# EAGLE design LibreServo_v1 (EAGLE 7.6.0)
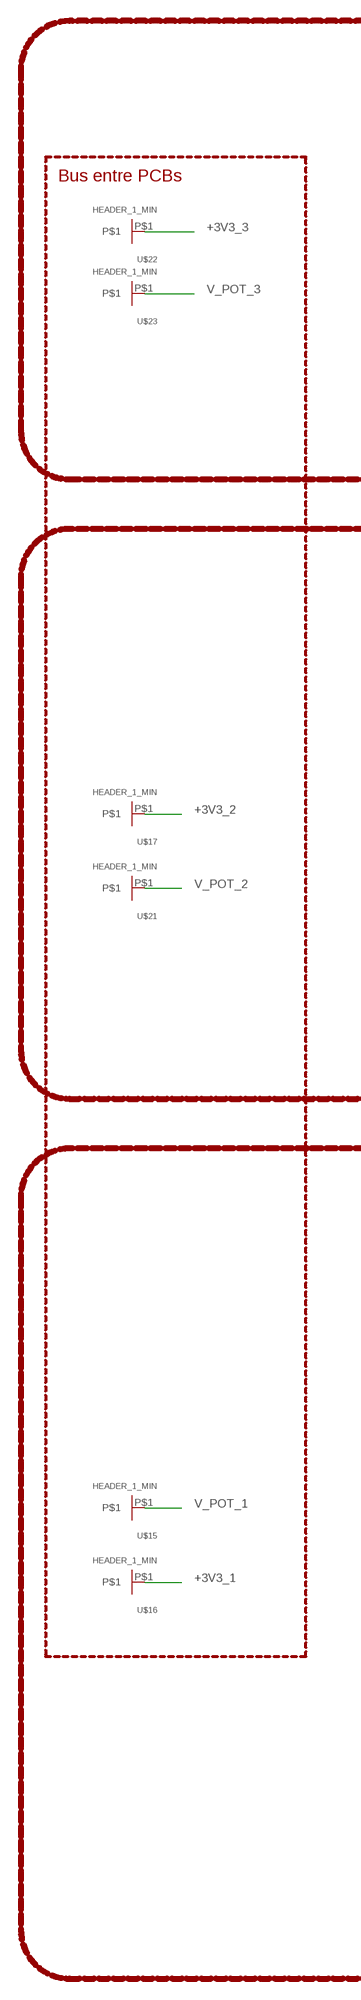
[diagram p0: schematic, sheet 1, part 1 of 2]
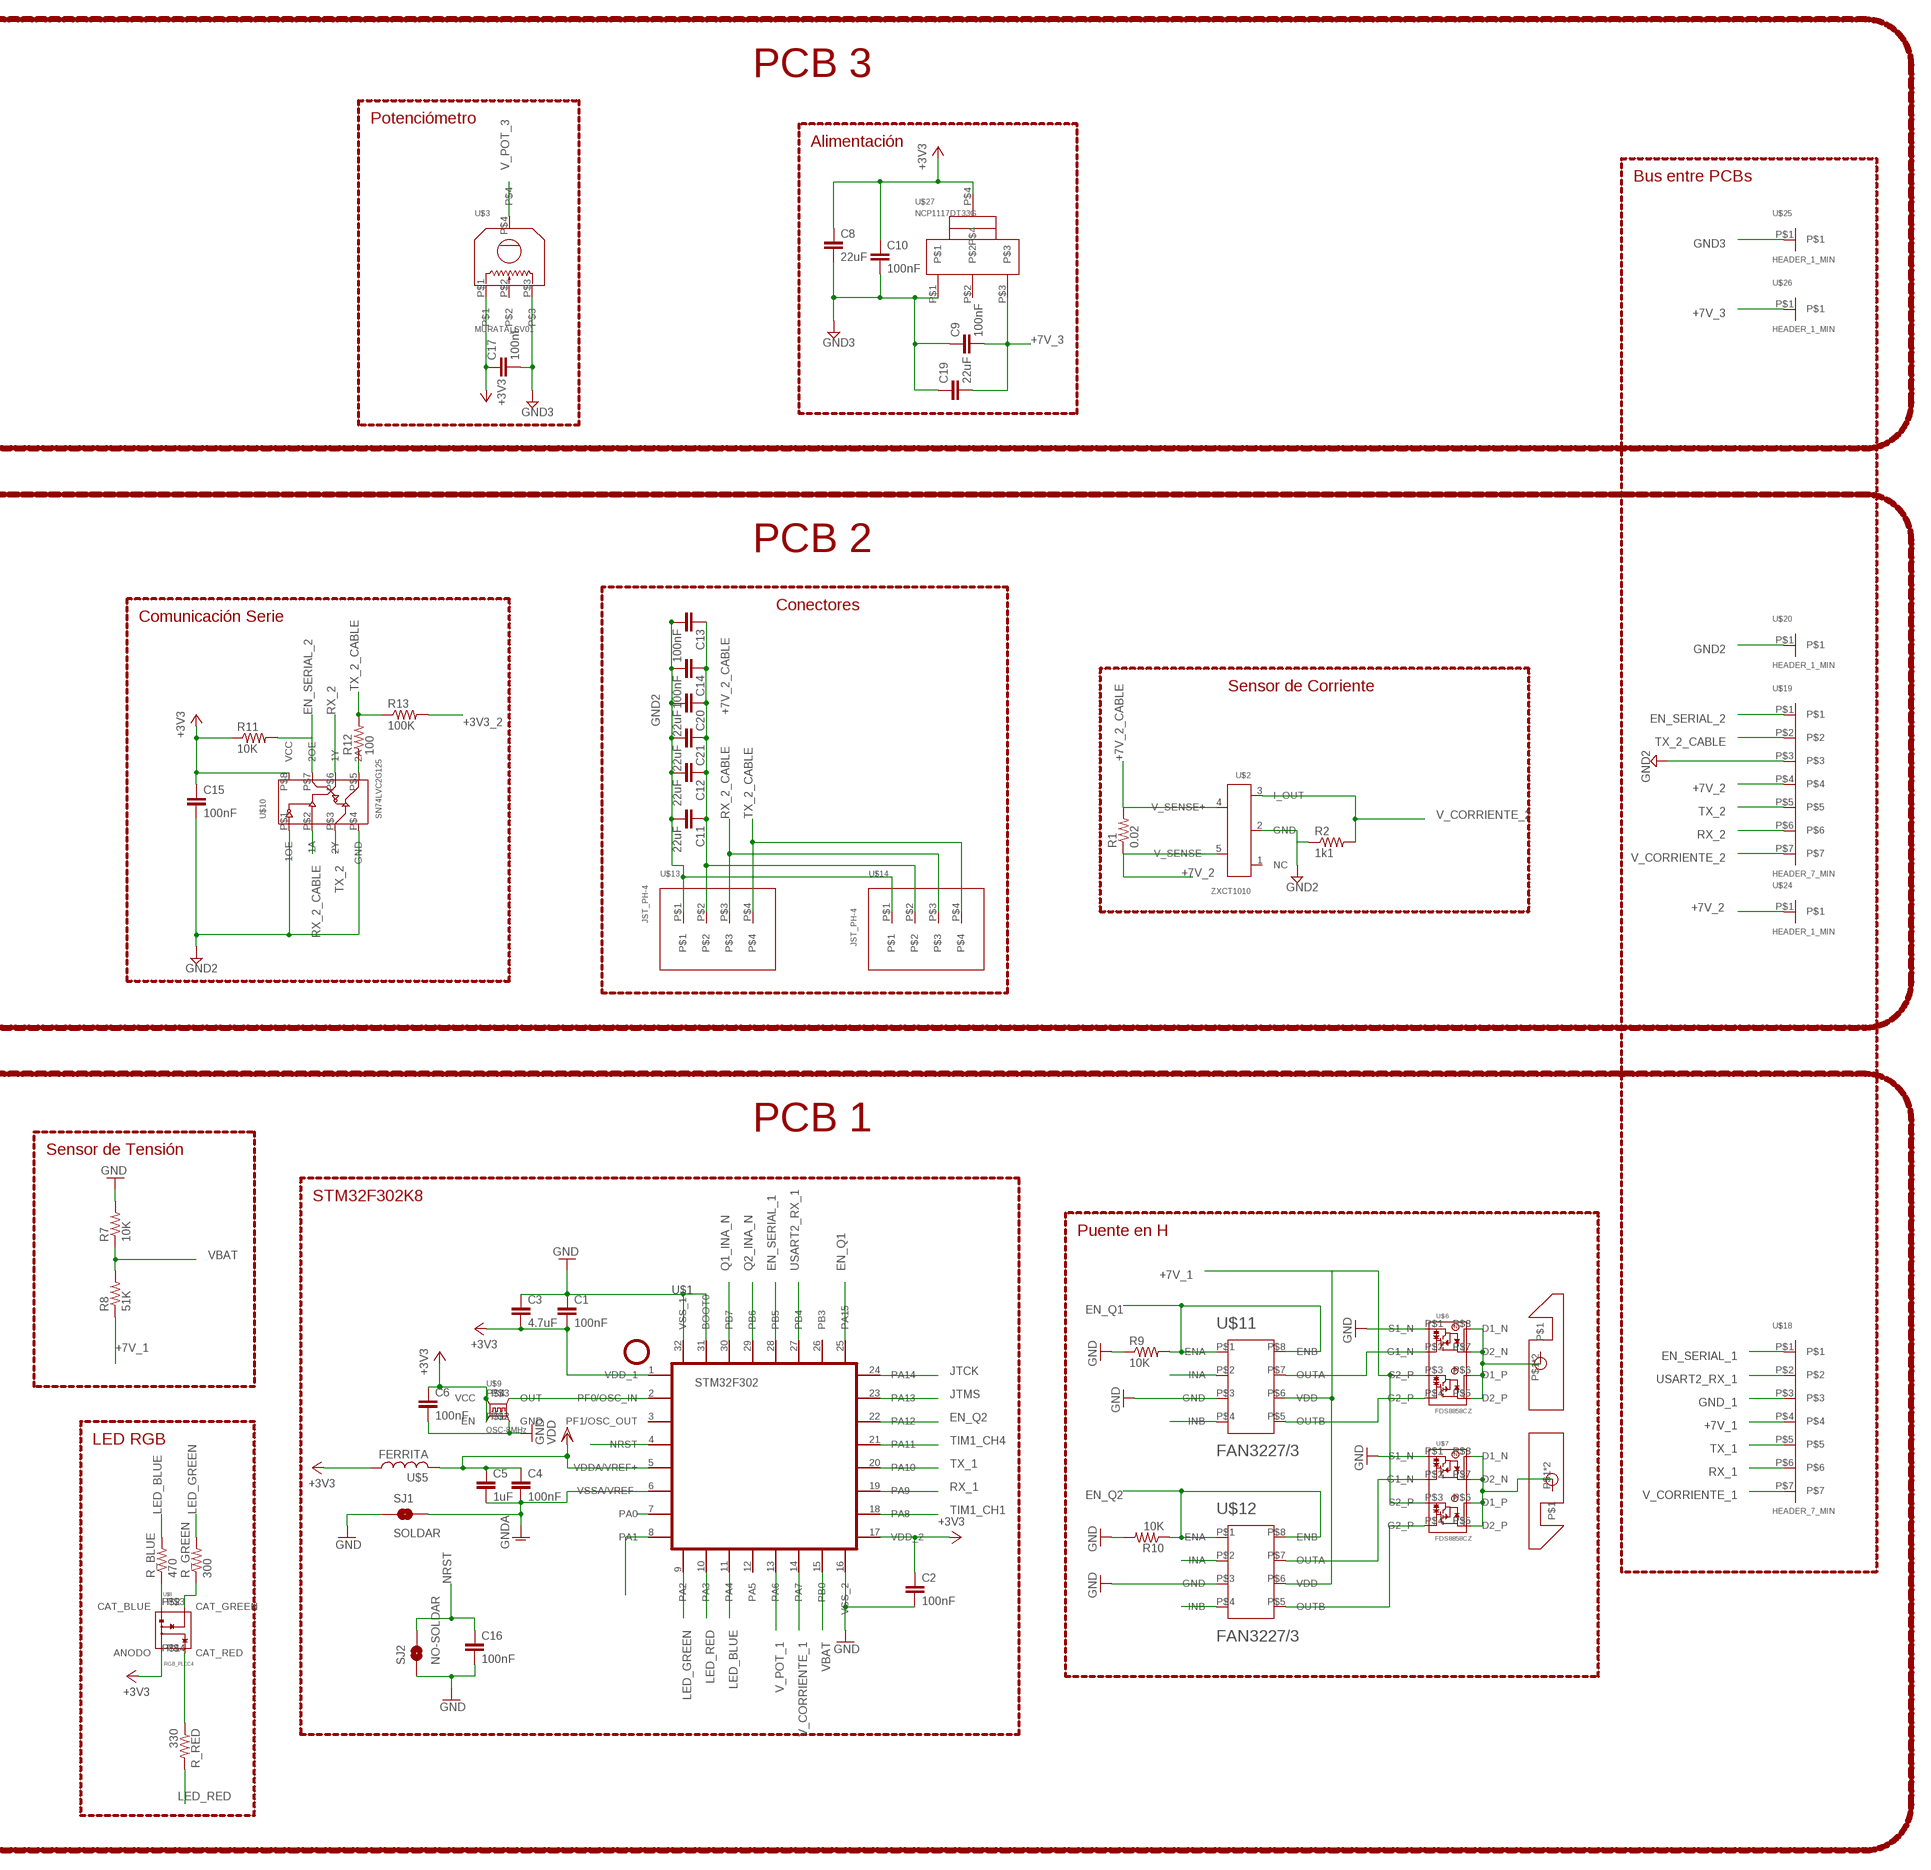
[diagram p1: schematic, sheet 1, part 2 of 2]

## Parts
C1  100nF  C-EUC0402  [C0402]
C2  100nF  C-EUC0402  [C0402]
C3  4.7uF  C-EUC0402  [C0402]
C4  100nF  C-EUC0402  [C0402]
C5  1uF  C-EUC0402  [C0402]
C6  100nF  C-EUC0402  [C0402]
C8  22uF  C-EU0805-MIN  [0805_MIN]
C9  100nF  C-EUC0402  [C0402]
C10  100nF  C-EUC0402  [C0402]
C11  22uF  C-EU0805-MIN  [0805_MIN]
C12  22uF  C-EU0805-MIN  [0805_MIN]
C13  100nF  C-EUC0402  [C0402]
C14  100nF  C-EUC0402  [C0402]
C15  100nF  C-EUC0402  [C0402]
C16  100nF  C-EUC0402  [C0402]
C17  100nF  C-EUC0402  [C0402]
C19  22uF  C-EU0805-MIN  [0805_MIN]
C20  22uF  C-EU0805-MIN  [0805_MIN]
C21  22uF  C-EU0805-MIN  [0805_MIN]
R1  0.02  R-US  [1206_ESTRECHA]
R2  1k1  R-US_R0402  [R0402]
R7  10K  R-US_R0402  [R0402]
R8  51K  R-US_R0402  [R0402]
R9  10K  R-US_R0402  [R0402]
R10  10K  R-US_R0402  [R0402]
R11  10K  R-US_R0402  [R0402]
R12  100  R-US_R0402  [R0402]
R13  100K  R-US_R0402  [R0402]
R_BLUE  470  R-US_R0402  [R0402]
R_GREEN  300  R-US_R0402  [R0402]
R_RED  330  R-US_R0402  [R0402]
SJ1  SOLDAR  SOLDERJUMPERNC  [SJ_2S]
SJ2  NO-SOLDAR  SOLDERJUMPERNO  [SJ_2S-NO]
U$1  STM32F302  [QFN32]
U$2  ZXCT1010  [SOT25]
U$3  MURATA_SV01  MURATA_SV01MURA  [MURATA_SV01]
U$4  PAD_LIBRE_SERVO_V1_A  [PAD_LIBRE_SERVO_V1_A]
U$5  FERRITA  FERRITE_BEAD_0402  [0402]
U$6  FDS8858CZ  [SO-8]
U$7  FDS8858CZ  [SO-8]
U$8  RGB_PLCC4  LED_RGB_PLCC4  [PLCC4]
U$9  OSC-8MHz  OSC-2.5X2OSC  [OSC-2.5X2]
U$10  SN74LVC2G125  [VSSOP-8]
U$11  FAN3227/3  [MLP8]
U$12  FAN3227/3  [MLP8]
U$13  JST_PH-4  JST_PH-4_HOLE  [JST_PH-4_HOLE]
U$14  JST_PH-4  JST_PH-4_HOLE  [JST_PH-4_HOLE]
U$15  HEADER_1_MIN  [HEADER_1_MIN]
U$16  HEADER_1_MIN  [HEADER_1_MIN]
U$17  HEADER_1_MIN  [HEADER_1_MIN]
U$18  HEADER_7_MIN  [HEADER_7_MIN]
U$19  HEADER_7_MIN  [HEADER_7_MIN]
U$20  HEADER_1_MIN  [HEADER_1_MIN]
U$21  HEADER_1_MIN  [HEADER_1_MIN]
U$22  HEADER_1_MIN  [HEADER_1_MIN]
U$23  HEADER_1_MIN  [HEADER_1_MIN]
U$24  HEADER_1_MIN  [HEADER_1_MIN]
U$25  HEADER_1_MIN  [HEADER_1_MIN]
U$26  HEADER_1_MIN  [HEADER_1_MIN]
U$27  NCP1117DT33G  NCP1117_MOD  [SOT223_MOD]
U$28  PAD_LIBRE_SERVO_V1_B  [PAD_LIBRE_SERVO_V1_B]

## Nets
+3V3_1: C1.2 C2.1 C3.2 C6.1 U$1.1(VDD_1) U$1.17(VDD_2) U$5.1 U$8.P$1(ANODO) U$9.P$1(EN) U$9.P$4(VCC) U$16.P$1 ; supply symbol labelled +3V3
+3V3_2: C15.1 R11.1 R13.2 U$10.P$8(VCC) U$17.P$1 ; supply symbol labelled +3V3
+3V3_3: C8.1 C10.1 C17.1 U$3.P$1 U$22.P$1 U$27.P$4 ; supply symbol labelled +3V3
+7V_1: R8.1 U$6.P$3(S2_P) U$7.P$3(S2_P) U$11.P$6(VDD) U$12.P$6(VDD) U$18.P$4
+7V_2: R1.1 U$2.5(V_SENSE-) U$19.P$4 U$24.P$1
+7V_2_CABLE: C11.1 C12.1 C13.1 C14.1 C20.1 C21.1 R1.2 U$2.4(V_SENSE+) U$13.P$2 U$14.P$2
+7V_3: C9.2 C19.2 U$26.P$1 U$27.P$3
EN_Q1: R9.2 U$1.25(PA15) U$11.P$1(ENA) U$11.P$8(ENB)
EN_Q2: R10.1 U$1.22(PA12) U$12.P$1(ENA) U$12.P$8(ENB)
EN_SERIAL_1: U$1.28(PB5) U$18.P$1
EN_SERIAL_2: R11.2 U$10.P$7(2OE) U$19.P$1
GND2: C11.2 C12.2 C13.2 C14.2 C15.2 C20.2 C21.2 R2.1 U$2.2(GND) U$10.P$1(1OE) U$10.P$4(GND) U$13.P$1 U$14.P$1 U$19.P$3 U$20.P$1
GND3: C8.2 C9.1 C10.2 C17.2 C19.1 U$3.P$3 U$25.P$1 U$27.P$1
GND_1: C1.1 C2.2 C3.1 C6.2 C16.2 R7.2 R9.1 R10.2 SJ1.1 SJ2.1 U$1.16(VSS_2) U$1.31(BOOT0) U$1.32(VSS_1) U$6.P$1(S1_N) U$7.P$1(S1_N) U$9.P$2(GND) U$11.P$3(GND) U$12.P$3(GND) U$18.P$3 ; supply symbol labelled GND
GNDA: C4.2 C5.2 SJ1.2 U$1.6(VSSA/VREF-)
JTCK: U$1.24(PA14)
JTMS: U$1.23(PA13)
LED_BLUE: R_BLUE.2 U$1.11(PA4)
LED_GREEN: R_GREEN.2 U$1.9(PA2)
LED_RED: R_RED.2 U$1.10(PA3)
N$1: R_BLUE.1 U$8.P$2(CAT_BLUE)
N$2: R_GREEN.1 U$8.P$3(CAT_GREEN)
N$3: R_RED.1 U$8.P$4(CAT_RED)
N$5: U$1.2(PF0/OSC_IN) U$9.P$3(OUT)
N$6: U$1.8(PA1)
N$7: U$1.7(PA0)
N$8: R12.1 U$10.P$5(2A)
N$10: U$6.P$2(G1_N) U$11.P$7(OUTA)
N$14: U$6.P$4(G2_P) U$11.P$5(OUTB)
N$15: U$7.P$2(G1_N) U$12.P$7(OUTA)
N$18: U$7.P$4(G2_P) U$12.P$5(OUTB)
N$19: U$6.P$5(D2_P) U$6.P$6(D1_P) U$6.P$7(D2_N) U$6.P$8(D1_N) U$28.P$1 U$28.P$2
N$26: U$4.P$1 U$4.P$2 U$7.P$5(D2_P) U$7.P$6(D1_P) U$7.P$7(D2_N) U$7.P$8(D1_N)
NRST: C16.1 SJ2.2 U$1.4(NRST)
Q1_INA_N: U$1.30(PB7) U$11.P$2(INA)
Q2_INA_N: U$1.29(PB6) U$12.P$2(INA)
RX_1: U$1.19(PA9) U$18.P$6
RX_2: U$10.P$6(1Y) U$19.P$6
RX_2_CABLE: U$10.P$2(1A) U$13.P$3 U$14.P$3
TIM1_CH1: U$1.18(PA8) U$12.P$4(INB)
TIM1_CH4: U$1.21(PA11) U$11.P$4(INB)
TX_1: U$1.20(PA10) U$18.P$5
TX_2: U$10.P$3(2Y) U$19.P$5
TX_2_CABLE: R12.2 R13.1 U$13.P$4 U$14.P$4 U$19.P$2
USART2_RX_1: U$1.27(PB4) U$18.P$2
V_CORRIENTE_1: U$1.14(PA7) U$18.P$7
V_CORRIENTE_2: R2.2 U$2.3(I_OUT) U$19.P$7
V_POT_1: U$1.13(PA6) U$15.P$1
V_POT_2: U$21.P$1
V_POT_3: U$3.P$4 U$23.P$1
VBAT: R7.1 R8.2 U$1.15(PB0)
VDD: C4.1 C5.1 U$1.5(VDDA/VREF+) U$5.2
Unconnected: U$1.3(PF1/OSC_OUT) U$1.12(PA5) U$1.26(PB3) U$2.1(NC) U$3.P$2 U$27.P$2

## Notes on the sheet
- PCB 3
- Potenciómetro
- Alimentación
- Bus entre PCBs
- Bus entre PCBs
- PCB 2
- Conectores
- Comunicación Serie
- Sensor de Corriente
- PCB 1
- Sensor de Tensión
- STM32F302K8
- Puente en H
- LED RGB

## Library data of the parts
C1-C6 C9 C10 C13-C17 = rcl:C-EU: CAPACITOR, European symbol
C8 C11 C12 C19-C21 = Propio:C-EU
R1 = Propio:R-US
R2 R7-R13 R_BLUE R_GREEN R_RED = rcl:R-US_: RESISTOR, American symbol
SJ1 SJ2 = SparkFun-Passives:SOLDERJUMPER: Solder Jumper Standard SMD solder jumper. Used to automate production. Two varients : Normally Open and Normally Closed are the same, but have different paste layers. NC will have a large amount of paste and should jumper during reflow.
U$1 = Propio:STM32F302
U$2 = Propio:ZXCT1010
U$3 = Propio:MURATA_SV01: MURATA SV01, SV03 BOURNS 3382G
U$4 = Propio:PAD_LIBRE_SERVO_V1_A
U$5 = Propio:FERRITE_BEAD_0402
U$6 U$7 = Propio:FDS8858CZ
U$8 = Propio:LED_RGB_PLCC4
U$9 = Propio:OSC-2.5X2
U$10 = Propio:SN74LVC2G125
U$11 U$12 = Propio:FAN3227/3
U$13 U$14 = Propio:JST_PH-4_HOLE
U$15-U$17 U$20-U$26 = Propio:HEADER_1_MIN
U$18 U$19 = Propio:HEADER_7_MIN
U$27 = Propio:NCP1117_MOD
U$28 = Propio:PAD_LIBRE_SERVO_V1_B

## Board
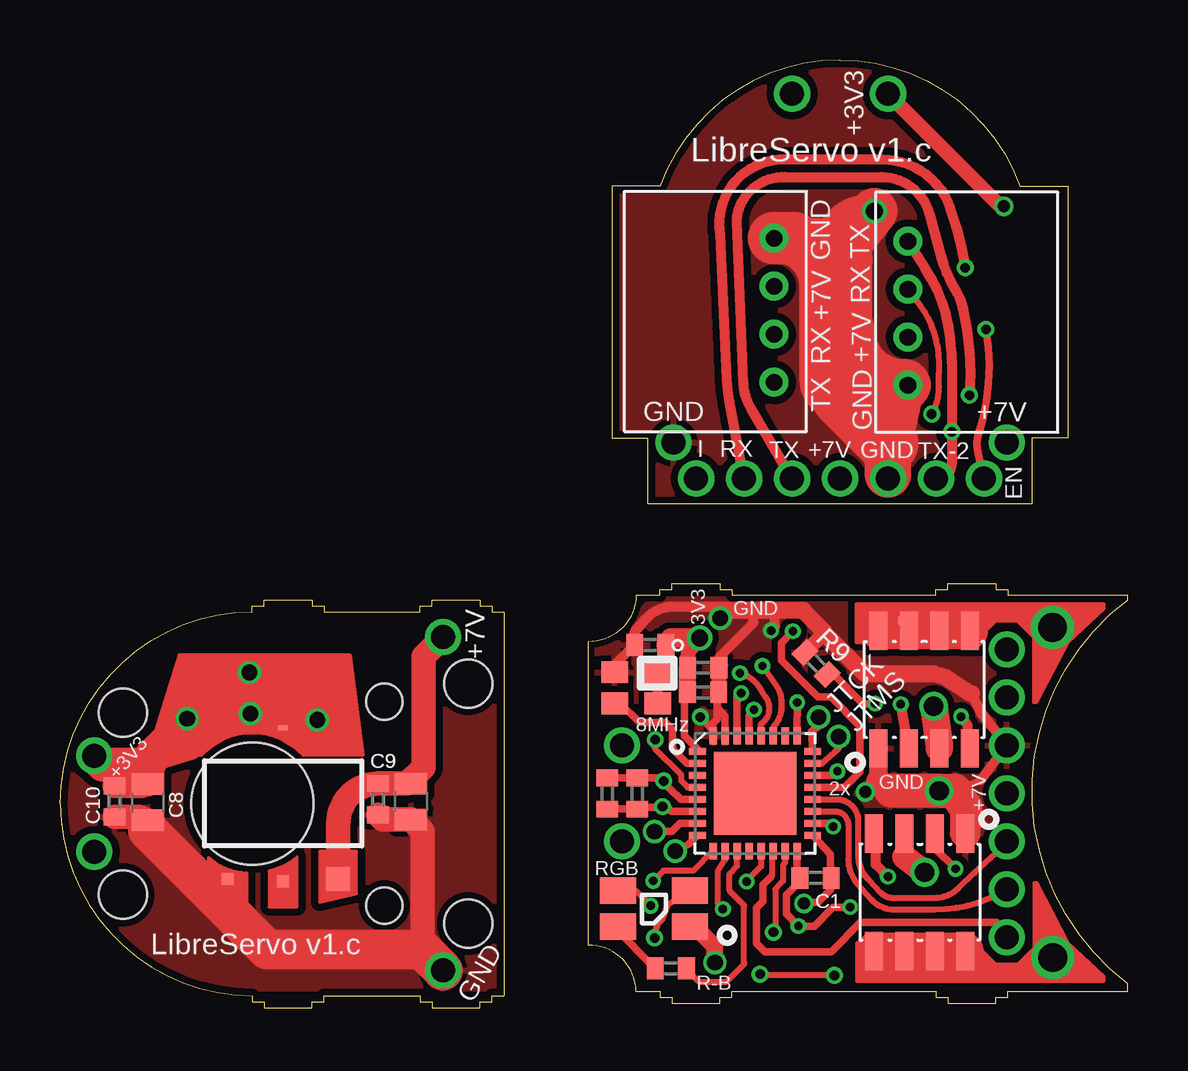
[diagram p2: board, top side]
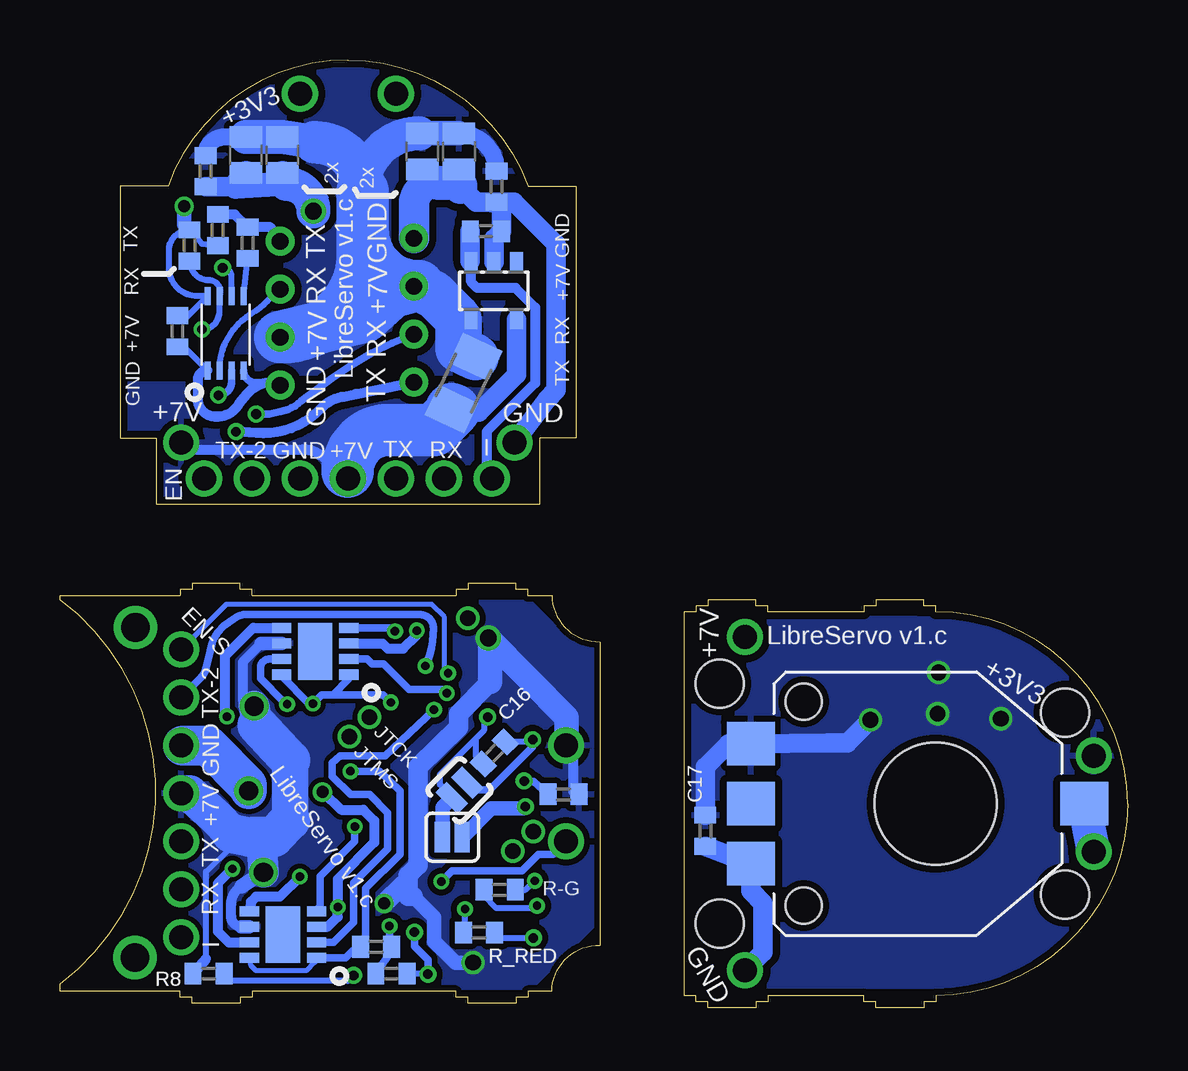
[diagram p3: board, bottom side, seen from below]

Size 44.5 x 39.5 mm. Coordinates in mm from the lower left corner, seen from the top.
Outline: 24,0.68 25,0.68 25,0.42 25.5,0.42 25.5,0.17 27.5,0.17 27.5,0.42 28,0.42 28,0.68 36.5,0.68 36.5,0.42 37,0.42 37,0.17 39,0.17 39,0.42 39.5,0.42 39.5,0.68 44.5,0.68 44.5,1 arc-106 44.5,17 44.5,17.18 39.5,17.18 39.5,17.43 39,17.43 39,17.68 37,17.68 37,17.43 36.5,17.43 36.5,17.18 28,17.18 28,17.43 27.5,17.43 27.5,17.68 25.5,17.68 25.5,17.43 25,17.43 25,17.18 24,17.18 arc-90 22,15.25 22,2.6 arc-90 24,0.68
Outline: 18.5,16.5 18.5,0.5 18,0.5 18,0.25 17.5,0.25 17.5,0 15.5,0 15.5,0.25 15,0.25 15,0.5 11,0.5 11,0.25 10.5,0.25 10.5,0 8.5,0 8.5,0.25 8,0.25 8,0.5 arc-90 0,8.5 arc-90 8,16.5 8,16.75 8.5,16.75 8.5,17 10.5,17 10.5,16.75 11,16.75 11,16.5 15,16.5 15,16.75 15.5,16.75 15.5,17 17.5,17 17.5,16.75 18,16.75 18,16.5 18.5,16.5
Outline: 40.5,23.75 40.5,21 24.5,21 24.5,23.75 23,23.75 23,34.25 25,34.25 arc-70 32.5,39.5 arc-70 40,34.25 42,34.25 42,23.75 40.5,23.75
Copper layers (1*16): Top 0.035mm / dielectric 1.5mm / Bottom 0.035mm
Design rules "SeeedStudio_2layer_DRU_no_angle_20140221": minimum track width 6mil, minimum drill 12mil, track to track 6mil, track to pad 6mil, pad to pad 6mil, via to via 6mil, smd to smd 0mil, copper to edge 10mil, drill to drill 10mil, minimum pad ring 10mil, minimum via ring 6mil, stop-mask expansion 2mil, vias tented up to drill 100mil, thermal gap 10mil
Holes 2 mm at 2.6,12.3 2.6,4.7 17,13.5 17,3.5

### Footprints (pad centres in the part's own frame; a part is rotated, then mirrored left to right if it is on the bottom)
C0402 = smd 0.7 x 0.9: 1 -0.65,0; 2 0.65,0
0805_MIN = smd 0.9 x 1.35: 1 -0.75,0; 2 0.75,0
1206_ESTRECHA = smd 1.4 x 1.8: 1 -1.2,0; 2 1.2,0
R0402 = smd 0.7 x 0.9: 1 -0.65,0; 2 0.65,0
SJ_2S = smd 0.635 x 1.27: 1 -0.412,0; 2 0.412,0
SJ_2S-NO = smd 0.635 x 1.27: 1 -0.45,0; 2 0.45,0
QFN32 = smd 0.3 x 0.7: 1 -1.75,-2.4; 2 -1.25,-2.4; 3 -0.75,-2.4; 4 -0.25,-2.4; 5 0.25,-2.4; 6 0.75,-2.4; 7 1.25,-2.4; 8 1.75,-2.4; 17 1.75,2.4; 18 1.25,2.4; 19 0.75,2.4; 20 0.25,2.4; 21 -0.25,2.4; 22 -0.75,2.4; 23 -1.25,2.4; 24 -1.75,2.4 | smd 0.7 x 0.3: 9 2.4,-1.75; 10 2.4,-1.25; 11 2.4,-0.75; 12 2.4,-0.25; 13 2.4,0.25; 14 2.4,0.75; 15 2.4,1.25; 16 2.4,1.75; 25 -2.4,1.75; 26 -2.4,1.25; 27 -2.4,0.75; 28 -2.4,0.25; 29 -2.4,-0.25; 30 -2.4,-0.75; 31 -2.4,-1.25; 32 -2.4,-1.75 | smd 3.45 x 3.45: EP 0,0
SOT25 = smd 0.55 x 0.8: 1 -0.95,-1.2; 2 0,-1.2; 3 0.95,-1.2; 4 0.95,1.2; 5 -0.95,1.2
MURATA_SV01 = smd 1.8 x 2: P$1 -2.5,-7.7; P$2 0,-7.7; P$3 2.5,-7.7; P$4 0,6.2 | hole 5.1: 0,0 | hole 1.5: -4.25,-5.5; 4.25,-5.5
PAD_LIBRE_SERVO_V1_A = smd 0.5 x 0.3: P$1 0,0 | drill 1.2: P$2 6.172,0.279
0402 = smd 0.7 x 0.9: 1 -0.65,0; 2 0.65,0
SO-8 = smd 1.6 x 0.75: P$1 -2.45,1.905; P$2 -2.45,0.635; P$3 -2.45,-0.635; P$4 -2.45,-1.905; P$5 2.45,-1.905; P$6 2.45,-0.635; P$7 2.45,0.635; P$8 2.45,1.905
PLCC4 = smd 1.1 x 1.5: P$1 -0.75,-1.5; P$2 -0.75,1.5; P$3 0.75,1.5; P$4 0.75,-1.5
OSC-2.5X2 = smd 0.9 x 1.1: P$1 -0.65,0.9; P$2 -0.65,-0.9; P$3 0.65,-0.9; P$4 0.65,0.9
VSSOP-8 = smd 0.75 x 0.25: P$1 -1.55,0.75; P$2 -1.55,0.25; P$3 -1.55,-0.25; P$4 -1.55,-0.75; P$5 1.55,-0.75; P$6 1.55,-0.25; P$7 1.55,0.25; P$8 1.55,0.75
MLP8 = smd 0.8 x 0.42: P$1 -1.4,0.975; P$2 -1.4,0.325; P$3 -1.4,-0.325; P$4 -1.4,-0.975; P$5 1.4,-0.975; P$6 1.4,-0.325; P$7 1.4,0.325; P$8 1.4,0.975 | smd 1.42 x 2.37: P$9 0,0
JST_PH-4_HOLE = drill 0.7: P$1 1.95,6.25; P$2 3.95,6.25; P$3 5.95,6.25; P$4 7.95,6.25
HEADER_1_MIN = drill 1: P$1 0,0
HEADER_7_MIN = drill 1: P$1 0,0; P$2 2,0; P$3 4,0; P$4 6,0; P$5 8,0; P$6 10,0; P$7 12,0
SOT223_MOD = smd 0.5 x 0.5: P$1 -2.3,-3.15; P$2 0,-3.252 | smd 1 x 1: P$3 2.3,-3.15 | smd 0.406 x 0.203: P$4 0,3.15
PAD_LIBRE_SERVO_V1_B = smd 0.5 x 0.3: P$1 0,0 | drill 1.2: P$2 6.172,-0.279

### Placement (x,y rotation side)
C1  31.47,5.4 0 top
C2  26.79,13.14 0 top
C3  26.8,14.17 180 top
C4  24.05,8.93 270 top
C5  22.8,8.93 270 top
C6  24.59,15.12 180 top
C8  3.65,8.55 270 top
C9  13.24,8.69 90 top
C10  2.26,8.6 270 top
C11  35.22,35.54 270 bottom
C12  36.75,35.54 270 bottom
C13  38.43,34.86 270 bottom
C14  26.3,34.22 270 bottom
C15  39.61,28.19 270 bottom
C16  26.39,10.61 225 bottom
C17  17.6,7.37 270 bottom
C19  14.61,8.59 90 top
C20  29.39,35.69 270 bottom
C21  27.87,35.69 270 bottom
R1  27.68,26.03 65 bottom
R2  26.75,32.36 180 bottom
R7  30.69,1.41 180 bottom
R8  38.31,1.41 0 bottom
R9  31.5,14.34 315 top
R10  31.32,2.53 0 bottom
R11  39.1,31.77 270 bottom
R12  36.68,31.88 90 bottom
R13  37.92,32.41 270 bottom
R_BLUE  25.44,1.64 0 top
R_GREEN  26.17,4.91 0 bottom
R_RED  27.03,3.13 180 bottom
SJ1  28.15,7.1 0 bottom
SJ2  27.84,9.06 45 bottom
U$1  28.96,8.93 270 top
U$2  26.41,29.88 180 bottom
U$3  8,8.5 270 bottom
U$4  35.2,1.8 0 top
U$5  23.51,8.89 180 bottom
U$6  36.01,13.25 90 top
U$7  35.82,4.81 270 top
U$8  24.74,4.12 90 top
U$9  24,13.33 270 top
U$10  37.6,28.11 90 bottom
U$11  33.86,14.85 180 bottom
U$12  35.21,3.04 180 bottom
U$13  41.58,23.99 90 top
U$14  23.5,34.01 270 top
U$15  23.4,6.92 0 top
U$16  23.4,10.93 0 top
U$17  34.5,38.1 270 top
U$18  39.45,14.93 270 top
U$19  38.5,22.05 180 top
U$20  25.55,23.55 270 top
U$21  30.5,38.1 270 top
U$22  1.4,10.5 0 top
U$23  1.4,6.5 0 top
U$24  39.45,23.55 270 top
U$25  15.95,1.55 0 top
U$26  15.95,15.45 0 top
U$27  9.28,8.51 0 top
U$28  35.18,16.12 0 top

### Tracks (layer width: path | path; a pad name or v marks a point on that pad's centre or on a via)
+3V3_1  (via drill 0.5, 0.65, 0.7)
  Top 0.305: U$1.1 26.61,10.72 26.01,11.32 26.01,13.01 C2.1 | v30.99,4.33 31.04,4.39 31.58,4.39 32.1,4.91 C1.2 32.1,6.39 U$1.17
  Top 0.406: U$9.P$4 U$9.P$1 25.24,14.19 C6.1
  Top 0.61: C2.1
  Top 0.635: C3.2 26.17,14.87 v26.65,15.41
  Top 0.711: C2.1 C3.2 | v27.28,1.87 27.28,2.53 26.45,3.37 U$8.P$1
  Top 0.813: C6.1 25.43,15.41 v26.65,15.41
  Bottom 0.305: 23.1,9 U$5.1
  Bottom 0.406: 23.1,9 23.1,10.62 arc-90 U$16.P$1
  Bottom 0.61: 29.78,4.63 28.91,3.75 28.91,2.77 28.01,1.87 v27.28,1.87
  Bottom 0.813: 29.99,5.12 29.99,4.63 29.78,4.63 | 29.99,5.12 29.99,5.52 29.57,5.94 29.57,10.03 27.89,11.68 27.89,12.23 26.57,13.58 | 26.57,15.33 v26.65,15.41 | v30.99,4.33 30.2,5.12 29.99,5.12 | U$16.P$1 23.38,10.93
  Bottom 1.016: v26.65,15.41 23.38,12.1 23.38,10.93 | 26.57,13.58 26.57,15.33
  pour Bottom (isolate 0.254, rank 2): 22.05,15.21 22.05,3.68 24.89,0.84 25.3,0.84 32.89,0.84 33.38,1.32 33.38,4.95 31.5,6.83 31.5,10.87 29.03,13.34 29.03,15.7 27.84,16.89 24.92,16.89 23.55,15.52 23.24,15.21
+3V3_2  (via drill 0.5)
  Top 0.61: U$17.P$1 39.17,33.43 39.29,33.43 v39.32,33.4
  Bottom 0.254: C15.1 39.38,28.62 U$10.P$8 38.78,29.66 arc90 39.95,30.84 39.95,31.56 arc90 R11.1 38.58,31.84 R13.2
  Bottom 0.61: v39.32,33.4 39.32,32.64 R11.1
+3V3_3  (via drill 0.65)
  Top 0.254: 6.78,12.06 7.99,11.66 | 7.99,11.66 7.99,12.18 v7.92,12.24 | U$27.P$4 7.99,11.66
  Top 1.016: C10.1 3.39,9.24 C8.1 3.99,10.39 5.41,10.82 6.78,12.06
  Top 1.422: U$22.P$1 1.77,10.13 3.45,10.13 5.28,11.96 v5.28,12.04
  Bottom 0.813: C17.1 17.6,10.04 16.64,11 U$3.P$1 12.5,11.02 11.68,11.02 v10.72,11.99
  other vias: 7.87,13.97
  pour Bottom (isolate 0.305): 7.7,16.2 arc90 0,8.5 arc90 7.62,0.88 8.86,0.88 9.87,0.88 14.62,0.88 15.33,0.88 16.91,0.88 17.62,0.88 18.5,0.88 18.5,16.22 17.72,16.22 17.22,16.22 16.03,16.22 14.7,16.2 10.67,16.2 9.95,16.2 8.79,16.2 14.72,16.22
+7V_1  (via drill 0.8)
  Top 0.762: 35.19,6.28 U$7.P$3
  Top 1.016: v36.02,5.63 35.19,6.28
  Top 1.143: v36.4,12.56 36.64,10.95 U$6.P$3
  Bottom 0.203: 38.41,5.66 37.32,6.72 37.32,7.46 37.35,7.27
  Bottom 0.254: 38.41,2.04 38.41,5.66
  Bottom 0.406: v36.02,5.63 36.2,5.58 | 38.41,2.04 R8.1 | 36.11,15.18 36.88,14.4 36.88,12.82 36.86,12.82 36.86,12.56 v36.4,12.56 | 36.94,3.37 arc90 37.36,3.79 37.36,4.31 arc60 36.93,5.05
  Bottom 0.559: U$11.P$6 36.11,15.18 | U$12.P$6 36.94,3.37
  Bottom 0.61: 36.93,5.05 arc-11 36.2,5.58
  Bottom 0.813: 36.58,7.1 36.05,6.57 36.07,6.55
  Bottom 1.27: v36.4,12.56 36.26,11.77 | 36.07,6.55 v36.02,5.63
  Bottom 1.524: 34.9,10.3 34.9,7.82 | U$18.P$4 39.09,8.93 38.05,7.99 37.35,7.27
  Bottom 1.676: 37.35,7.27 36.58,7.1 35.59,7.1 34.9,7.82 | 36.26,11.77 34.9,10.3
  pour Bottom (isolate 0.203): 34.11,15.57 32.28,13.74 32.28,6.35 36.04,2.59 37.8,2.59 40.56,5.36 40.56,10.31 37.97,12.9 37.97,14.2 37.97,14.81 36.91,15.88 34.42,15.88 34.14,15.6
+7V_2
  Bottom 0.406: U$24.P$1 39.17,23.27 34.37,23.27 arc90 33.12,22.02 32.53,22.02 arc-90 U$19.P$4 32.5,22.34 arc-90 32.51,22.35
  Bottom 0.813: U$2.5 25.46,26.38 27.02,24.82 R1.1
  Bottom 1.422: U$19.P$4 32.5,22.26
  Bottom 2.184: 32.51,22.35 arc90 30.79,24.08 28.91,24.08 28.07,24.91 R1.1
  pour Bottom (isolate 0.305): 23,26 23,24 25,24 25,21 40,21 41,21 41,24 42,24 42,26
+7V_2_CABLE
  Bottom 0.711: C14.1 C14.1 arc-90 C21.1 | C12.1 37.65,36.29 arc-90 C13.1
  Bottom 0.813: R1.2 27.81,28.24 U$2.4
  Bottom 1.016: 29.5,36.44 C20.1 C21.1
  Bottom 1.422: 29.5,36.44 arc-90 31.88,34.06 | 33.88,36.07 C11.1 C12.1
  Bottom 1.676: 31.88,34.04 31.88,34.06
  Bottom 1.778: 31.88,34.06 arc-90 33.88,36.07
  Bottom 1.93: R1.2 27.88,27.44 27.88,28.7 28.96,29.79 29.12,29.79 29.29,29.95 29.55,30.06 U$14.P$2
  Bottom 2.184: 31.88,32.54 31.88,31.39 arc90 U$13.P$2 31.82,28.81 30.72,29.81 U$14.P$2 | 31.88,32.54 31.88,34.04 | 29.55,30.06 arc90 31.88,32.39 31.88,32.54
  pour Bottom (isolate 0.305): 40,34.25 arc70 32.5,39.5 arc70 25,34.25 23,34.25 23,26.44 27.19,26.44 37.81,26.44 42,26.44 42,34.25
+7V_3
  Top 0.254: C19.2 14.46,9.34
  Top 1.016: U$27.P$3 11.58,7.67 arc-90 C9.2 14.46,9.34 15.14,10.02 15.14,14.64 U$26.P$1
EN_Q1  (via drill 0.35)
  Top 0.305: U$1.25 30.71,11.76 30.71,12.51 v30.71,12.72 | R9.2 32.24,13.88 33.45,12.67 v33.96,12.67
  Bottom 0.305: U$11.P$8 35.26,13.82 34.1,12.67 v33.96,12.67 33.6,13.03 33.12,13.03 | v30.71,12.72 31.02,13.03 31.55,13.03 33.12,13.03 | U$11.P$1 32.46,13.69 33.12,13.03
EN_Q2  (via drill 0.35)
  Top 0.305: U$1.22 32.22,9.68 v32.39,9.85
  Bottom 0.203: U$12.P$8 36.53,1.75 36.33,1.54 34.22,1.54 33.88,1.88 U$12.P$1
  Bottom 0.305: v32.39,9.85 31.17,9.85 30.33,9.03 30.33,6.39 31.75,4.97 31.75,2.75 R10.1 32.12,2.38 32.29,2.38 32.59,2.08 33.87,2.08 U$12.P$1
EN_SERIAL_1  (via drill 0.35)
  Top 0.254: U$1.28 29.21,11.84 arc65 29.55,12.52 arc40 29.39,12.95 29.19,13.28 arc43 v28.32,13.94
  Bottom 0.203: U$18.P$1 37.57,16.81 29.01,16.81 28.48,16.27 28.48,14.09 v28.32,13.94
EN_SERIAL_2  (via drill 0.4)
  Top 0.305: U$19.P$1 38.23,23.27 arc-31 38.25,23.8 arc28 v38.58,28.27
  Bottom 0.254: R11.2 R11.2 arc-90 38.3,30.33 arc110 37.85,29.68 U$10.P$7 37.85,29 arc90 v38.58,28.27
GND2  (via drill 0.7)
  Top 0.254: 32.33,26.11 32.56,25.89
  Top 0.406: U$19.P$3 34.5,22.22
  Top 1.422: 32.02,31.51 arc-90 33.71,33.2 v33.93,33.2 33.96,33.2 | U$13.P$1 U$19.P$3
  Top 1.93: 34.5,22.22 34.5,23.52 | 30.69,31.95 31.57,31.95 32.02,31.51 32.33,31.19 v33.93,33.2 | U$13.P$1 35.17,25.94 | U$14.P$1 arc-90 31.77,30.04 31.77,29.72 32.36,28.27
  Top 2.184: 35.17,25.94 arc-90 32.84,28.27 32.36,28.27 arc-90 32.33,28.3 | 30.69,31.95 arc90 30.57,32.06 U$14.P$1
  Top 2.54: 34.5,23.52 32.56,25.46 32.56,25.89
  Top 3.048: 32.33,26.11 32.33,28.3 32.33,31.19
  Bottom 0.254: C15.2 39.45,27.66 U$10.P$1
  Bottom 0.305: C14.2 26.3,33.54 26.31,33.53 26.54,33.3 | U$10.P$4 arc-90 36.34,26.05 35.84,26.05 35.44,26.05 arc90 U$13.P$1
  Bottom 0.406: U$10.P$1 arc-90 38.76,26.15 38.76,25.38 arc-90 38.02,24.64 37.95,24.64 arc-61 37.03,25.17 36.7,25.58 arc61 35.44,26.05
  Bottom 0.711: 27.82,34.22 27.82,34.89 arc-90 C21.2 | 28.8,34.39 28.84,34.39 arc90 C20.2
  Bottom 0.813: C13.2 37.17,34.22 | U$20.P$1 24.21,25.35 23.82,25.73 23.82,31.83 25.57,33.57 C14.2 | C14.2 26.1,33.36 R2.1 26.41,32.05 U$2.2 | C14.2 27.17,33.57 27.82,34.22
  Bottom 1.016: C12.2 37.17,34.22 35.07,34.33 C11.2
  Bottom 1.27: U$14.P$1 29.75,33.44 arc90 28.8,34.39
  Bottom 1.422: 35.07,34.33 arc90 v33.93,33.2 | 28.84,34.39 27.99,34.39 arc90 27.82,34.22
  pour Top (isolate 0.305): 23,23.75 23,34.25 25,34.25 arc-70 32.5,39.5 arc-70 40,34.25 42,34.25 42,23.75 40.5,23.75 40.5,21 24.5,21 24.5,23.75
GND3
  Top 1.016: 3.65,7.4 C8.2 3.31,7.95 C10.2 | C9.1 13.44,7.84 C19.1 15.09,7.36 15.09,2.41
  Top 1.676: U$25.P$1 15.09,2.41 8.64,2.41 6.77,4.28 | 6.77,4.28 3.65,7.4 | 6.77,4.28
  Bottom 0.813: C17.2 U$3.P$3 15.7,4.85 15.19,4.34 15.19,2.31 U$25.P$1
  pour Top (isolate 0.305): 7.7,16.2 arc90 0,8.5 arc90 7.7,0.8 8.55,0.8 9.95,0.8 11.3,0.8 15,0.8 15.68,0.8 17,0.8 17.67,0.8 18.5,0.8 18.5,16.2 17.7,16.2 16.93,16.2 16.05,16.2 15,16.2 10.7,16.2 9.18,16.2 8.45,16.2
GND_1  (via drill 0.35, 0.4, 0.5, 0.65, 0.8)
  Top 0.254: 31.81,15.64 31.75,15.58 31.75,15.51 | 38.35,9.47 37.29,9.03
  Top 0.305: v32.92,4.18 32.21,4.18 31.42,3.4 v30.76,3.4 30.25,3.9 30.25,4.69 30.8,5.24 C1.1 30.71,5.49 U$1.16 | v26.67,12.11 27.21,11.55 U$1.32 27.21,11.7 27.13,11.78 27.36,12.01 27.36,12.51 | 27.36,12.51 27.36,13.06 C2.2 | U$1.31 27.71,12.16 27.36,12.51
  Top 0.406: U$9.P$2 23.1,14.28 C6.2 23.94,15.65 24.43,16.23 arc-50 25.6,16.71 27.71,16.71 27.79,16.63 27.79,16.53 | C3.1 27.49,14.12 27.49,14.63 28.88,16.03 28.88,16.55 | 34.1,9.43 33.58,9.03 v33.56,8.98 | 37.98,13.07 38.38,12.26 U$18.P$3 38.35,9.47 | 29.79,16.55 29.79,15.89 v29.62,15.71 | v27.51,16.23 27.51,16.24 27.82,16.55
  Top 0.61: C2.2 C3.1 | 31.75,15.51 R9.1
  Top 0.711: 27.79,16.53 27.82,16.55 28.88,16.55 29.79,16.55 30.95,16.55 31.81,15.7 31.81,15.64 33.54,13.91 36.38,13.91 36.91,13.76 37.98,13.07
  Top 0.762: 34.1,9.43 U$6.P$1
  Top 1.016: 34.62,9.03 34.1,9.43
  Top 1.27: 37.73,8.37 U$7.P$1
  Top 1.422: 34.62,9.03 v36.63,9.03 37.29,9.03 37.73,8.37
  Bottom 0.254: v26.67,12.11 26.83,11.98 26.83,11.55 27.15,11.22 | 27.15,11.22 28.68,9.7 28.68,9.3 28.65,9.3 28.52,9.17 28.52,9.11 SJ2.1 | C16.2 27.15,10.45 27.15,11.22
  Bottom 0.305: R10.2 30.76,2.53 | 30.76,2.53 30.76,2.24 R7.2 | 30.76,2.53 v30.76,3.4
  Bottom 0.406: v33.56,8.98 32.77,8.25 31.86,8.25 31.4,7.79 31.4,6.88 32.92,5.35 v32.92,4.18 32.92,3.78 33.33,3.37 U$12.P$3 | U$11.P$3 31.05,15.18 30.84,14.96 30.2,14.96 29.62,15.54 v29.62,15.71
  Bottom 0.61: SJ1.1 28.56,8.34 SJ2.1
  Bottom 1.27: U$18.P$3 39.44,10.91 39.37,10.91
  Bottom 1.524: 36.71,9.26 v36.63,9.03
  Bottom 1.676: 36.71,9.26 38.33,10.91 39.37,10.91
  pour Top (isolate 0.254): 22.05,15.09 22.05,11.99 22.38,11.66 25.63,11.66 26.06,11.23 26.7,10.59 28.93,10.59 30.61,12.27 31.29,12.27 32.44,11.13 32.44,8.1 34.42,6.12 38.81,6.12 40.34,7.65 40.34,9.91 40.79,11.71 40.79,13.11 38.33,15.57 36.88,17.02 29.95,17.02 24.66,17.02 22.89,15.24 22.17,15.24 22.05,15.11
GNDA  (via drill 0.4)
  Top 0.305: C5.2 C4.2 24.13,8.35 24.94,8.35 25.03,8.3 v25.1,8.37 25.28,8.37 25.48,8.18 U$1.6
  Bottom 0.61: SJ1.2 26.53,8.3 25.18,8.3 v25.1,8.37
JTCK  (via drill 0.65)
  Top 0.305: U$1.24 31.31,11.51 31.6,11.73 v31.6,12.11
JTMS  (via drill 0.65)
  Top 0.254: U$1.23 31.75,10.18 32.44,10.79 v32.44,11.29
LED_BLUE
  Top 0.254: R_BLUE.2 26.52,1.19 26.64,1.07 27.76,1.07 28.5,1.81 28.5,1.91 28.5,4.26 27.89,4.87 27.89,5.58 28.21,5.9 U$1.11
LED_GREEN  (via drill 0.35)
  Top 0.254: U$1.9 26.38,5.7 25.13,5.7 v24.71,5.28
  Bottom 0.254: R_GREEN.2 25.09,4.91 v24.71,5.28
LED_RED  (via drill 0.35)
  Top 0.254: U$1.10 27.71,6.16 27.41,5.69 27.41,5.49 27.41,4.31 v27.61,4.11
  Bottom 0.254: R_RED.2 27.61,3.4 v27.61,4.11
N$1
  Top 0.305: R_BLUE.1 23.09,3.34 U$8.P$2
N$2  (via drill 0.35)
  Top 0.254: U$8.P$3 23.94,4.87 23.95,4.88 23.98,4.88 v24.61,4.24
  Bottom 0.254: v24.61,4.24 24.75,4.24 24.86,4.14 26.31,4.14 26.82,4.65 R_GREEN.1
N$3  (via drill 0.4)
  Top 0.254: U$8.P$4 25.32,4.3 25.1,3.69 24.92,3.51 24.77,3.1 v24.77,2.9
  Bottom 0.254: v24.77,2.9 26.15,2.9 R_RED.1
N$5
  Top 0.305: U$1.2 26.12,10.18 25.5,10.79 25.5,11.6 25.23,11.88 24.13,11.88 23.34,12.68 U$9.P$3
N$6  (via drill 0.65)
  Top 0.305: v25.63,6.53 26.19,6.8 U$1.8
N$7  (via drill 0.65)
  Top 0.305: v24.77,7.34 25.5,7.34 25.84,7.67 U$1.7
N$8
  Bottom 0.254: U$10.P$5 R12.1
N$10  (via drill 0.35)
  Top 0.406: U$6.P$2 v35.03,12.64
  Bottom 0.305: v35.03,12.64 35.03,12.77 35.2,12.77 36.14,13.72 36.14,14.15 arc90 35.77,14.53 U$11.P$7
N$14  (via drill 0.35)
  Top 0.406: v37.55,12.13 37.82,11.78 37.82,10.89 U$6.P$4
  Bottom 0.406: v37.55,12.13 37.62,12.39 37.62,14.65 36.45,15.83 U$11.P$5
N$15  (via drill 0.35)
  Top 0.305: U$7.P$2 36.46,6.64 v37.32,5.78
  Bottom 0.406: v37.32,5.78 37.93,5.17 37.93,3.17 37.47,2.71 36.54,2.71 U$12.P$7
N$18  (via drill 0.35)
  Top 0.305: 33.99,7.19 U$7.P$4
  Top 0.406: 33.99,7.19 33.99,5.96 v34.5,5.45
  Bottom 0.406: v34.5,5.45 35.34,4.62 36.33,4.62 36.53,4.41 U$12.P$5
N$19
  Top 0.254: U$28.P$2 40.08,16.46 arc57 38.35,16.38 arc52 U$6.P$5
  Top 1.524: U$6.P$8 U$6.P$7 | U$6.P$7 U$6.P$6 U$6.P$5 | U$28.P$1 35.37,16.12 U$6.P$7
N$26
  Top 0.254: U$4.P$2 40.26,1.5 arc-60 38.61,1.57 arc-18 U$7.P$8
  Top 1.524: U$7.P$5 U$7.P$6 | U$7.P$6 U$7.P$7 U$7.P$8 | U$7.P$6 U$4.P$1
NRST  (via drill 0.4)
  Top 0.254: U$1.4 26.16,9.18 25.88,9.45 25.88,9.7 24.79,10.79 v24.79,11.17
  Bottom 0.254: v24.79,11.17 24.89,11.07 C16.1
  Bottom 0.305: SJ2.2 27.21,9.06 26.6,9.06 24.79,10.87 v24.79,11.17
Q1_INA_N  (via drill 0.35)
  Top 0.305: U$1.30 28.21,12.93 v28.38,13.1
  Bottom 0.305: v28.38,13.1 28.45,13.25 29.94,13.25 31.01,14.33 31.5,14.33 31.7,14.53 U$11.P$2
Q2_INA_N  (via drill 0.35)
  Top 0.305: U$1.29 28.71,12.16 v28.91,12.41
  Bottom 0.305: v28.91,12.41 30.94,10.48 32.82,10.48 33.15,10.2 33.15,9.64 32.39,8.88 31.6,8.88 30.84,8.12 30.84,6.62 32.26,5.2 32.26,3.55 33.09,2.71 U$12.P$2
RX_1
  Top 0.254: U$1.19 32.29,8.18 arc-90 32.84,7.62 32.84,6.2 arc40 33.22,5.16 arc2 33.78,4.52 arc52 34.87,4.09 36.45,4.09 arc31 U$18.P$6
RX_2  (via drill 0.4)
  Top 0.406: U$19.P$6 27.89,25.27 arc-11 27.76,26.64 27.51,32.23 arc-95 29.98,35.36 34.25,35.36 arc-71 37.08,33.35 arc-10 v37.72,30.84
  Bottom 0.254: U$10.P$6 37.35,30.46 arc-90 v37.72,30.84
RX_2_CABLE  (via drill 0.4)
  Top 0.254: v36.32,24.74 arc30 36.63,25.88 36.63,26.47 arc8 36.55,27.58 arc29 35.87,29.23 U$13.P$3
  Bottom 0.254: U$10.P$2 37.85,26.7 arc55 36.52,28.93 arc-26 35.59,29.77 U$13.P$3
  Bottom 0.305: U$14.P$3 arc-17 33.15,26.24 34.44,25.27 arc29 35.31,24.84 35.78,24.74 v36.32,24.74
TIM1_CH1  (via drill 0.35)
  Top 0.305: U$1.18 32.07,7.67 v32.21,7.54
  Bottom 0.305: v32.21,7.54 32.21,6.93 33.66,5.48 33.66,4.24 U$12.P$4
TIM1_CH4  (via drill 0.35)
  Top 0.305: U$1.21 32.68,9.18 33.33,9.82 33.33,11.73 32.11,12.95 31.58,12.95 30.05,14.47 30.05,15.2 v30.53,15.69
  Bottom 0.305: v30.53,15.69 30.67,15.83 U$11.P$4
TX_1
  Top 0.254: U$1.20 32.37,8.68 arc-90 33.25,7.8 33.25,6.35 arc48 33.71,5.31 34.19,4.8 arc50 34.76,4.57 36.42,4.57 arc44 37.44,4.98 arc-1 39.45,6.85
  Top 0.305: 39.45,6.85 U$18.P$5
TX_2  (via drill 0.4)
  Top 0.406: U$19.P$5 28.78,24.99 arc-28 28.47,26.04 28.19,32.77 arc-90 30.22,34.62 34.22,34.62 arc-75 36.22,33.1 36.7,31.32 arc16 37.29,29.95 arc-18 37.62,29.13 arc-18 v37.9,25.53
  Bottom 0.305: v37.9,25.53 arc-90 37.35,26.07 U$10.P$3
TX_2_CABLE  (via drill 0.4)
  Top 0.406: U$19.P$2 arc90 37.16,22.71 v37.16,24 37.16,26.64 arc0 37.13,27.38 arc31 36.04,30.84 U$13.P$4
  Bottom 0.406: R13.1 37.21,33.06 R12.2 35.73,32.53 U$13.P$4 | v37.16,24 arc4 36.32,23.95 arc-52 33.63,24.97 arc35 32.77,25.45 32.16,25.58 U$14.P$4
USART2_RX_1  (via drill 0.35)
  Top 0.254: 29.79,11.77 arc59 29.79,11.77 | v29.26,14.24 29.87,13.36 arc-34 30.05,12.8 arc-2 30.05,12.42 arc-15 30.02,12.24 arc-23 29.79,11.77 | U$1.27 29.71,11.57 29.73,11.72 29.79,11.77
  Bottom 0.305: U$18.P$2 38.63,13.74 arc-34 38.41,14.17 arc6 38.15,15.19 arc34 37.67,15.9 37.26,16.2 arc43 36.61,16.38 29.52,16.38 arc90 28.93,15.8 arc24 v29.26,14.24
V_CORRIENTE_1
  Top 0.254: 29.59,5.43 29.67,5.5 29.67,6.54 U$1.14
  Top 0.305: U$18.P$7 39.45,3.12 39.02,3.55 33.35,3.55 32.13,2.33 29.37,2.33 29.01,2.68 29.01,4.16 29.29,4.44 29.29,5.12 29.59,5.43
V_CORRIENTE_2
  Bottom 0.406: U$19.P$7 26.5,22.42 26.71,22.63 26.71,24.01 24.69,26.03 24.69,29.18 25.5,30 27.11,30 27.36,30.25 U$2.3
  Bottom 0.61: U$2.3 arc90 27.4,31.11
  Bottom 0.813: 27.4,31.11 R2.2
V_POT_1  (via drill 0.35)
  Top 0.254: U$1.13 29.21,5.88 28.6,5.28 v28.6,5.25
  Bottom 0.305: U$15.P$1 23.95,6.38 24.56,6.38 25.25,5.69 28.16,5.69 v28.6,5.25
V_POT_3
  Bottom 1.422: U$23.P$1 U$3.P$4
VBAT  (via drill 0.4)
  Top 0.254: U$1.15 30.2,6.57 30.2,6.04 30.13,5.94 30.13,5.28 29.8,4.92 29.8,3.24 v29.72,3.14 | v32.26,1.34 29.21,1.34 v29.16,1.39
  Bottom 0.254: v32.26,1.34 32.49,1.11 37.34,1.11 R8.2 | v29.16,1.39 29.2,1.41 R7.1
  Bottom 0.305: v29.72,3.14 29.72,2.56 29.16,2 v29.16,1.39
VDD  (via drill 0.4)
  Top 0.305: C5.1 C4.1 24.96,9.57 v25.15,9.44 25.06,9.44 25.86,8.68 U$1.5
  Bottom 0.305: U$5.2 24.76,9.43 v25.15,9.44

### Text on the board
tPlace: JTCK | JTMS
bPlace: JTCK | JTMS
tNames: +3V3 | LibreServo v1.c | GND | TX | +7V | RX | RX | GND | +7V | GND | TX | I | +7V | RX | TX | +7V | GND | TX-2 | EN | 3V3 | GND | +7V | 8MHz | +3V3 | 2x | GND | +7V | RGB | LibreServo v1.c | R-B | GND
bNames: +3V3 | 2x | GND | 2x | LibreServo v1.c | GND | TX | +7V | +7V | TX | RX | RX | +7V | +7V | RX | RX | GND | GND | TX | TX | GND | RX | TX | +7V | GND | TX-2 | +7V | I | EN | EN-S | LibreServo v1.c | +7V | +3V3 | TX-2 | GND | +7V | TX | R-G | LibreServo v1.c | RX | I | GND
bValues: SN74LVC2 | GND | 3v3
_tNames: R9 | C9 | C10 | C8 | C1
_bNames: C16 | C17 | R_RED | R8